# Altium schematic sheet UART Communication.SchDoc: UART Communication
size A2
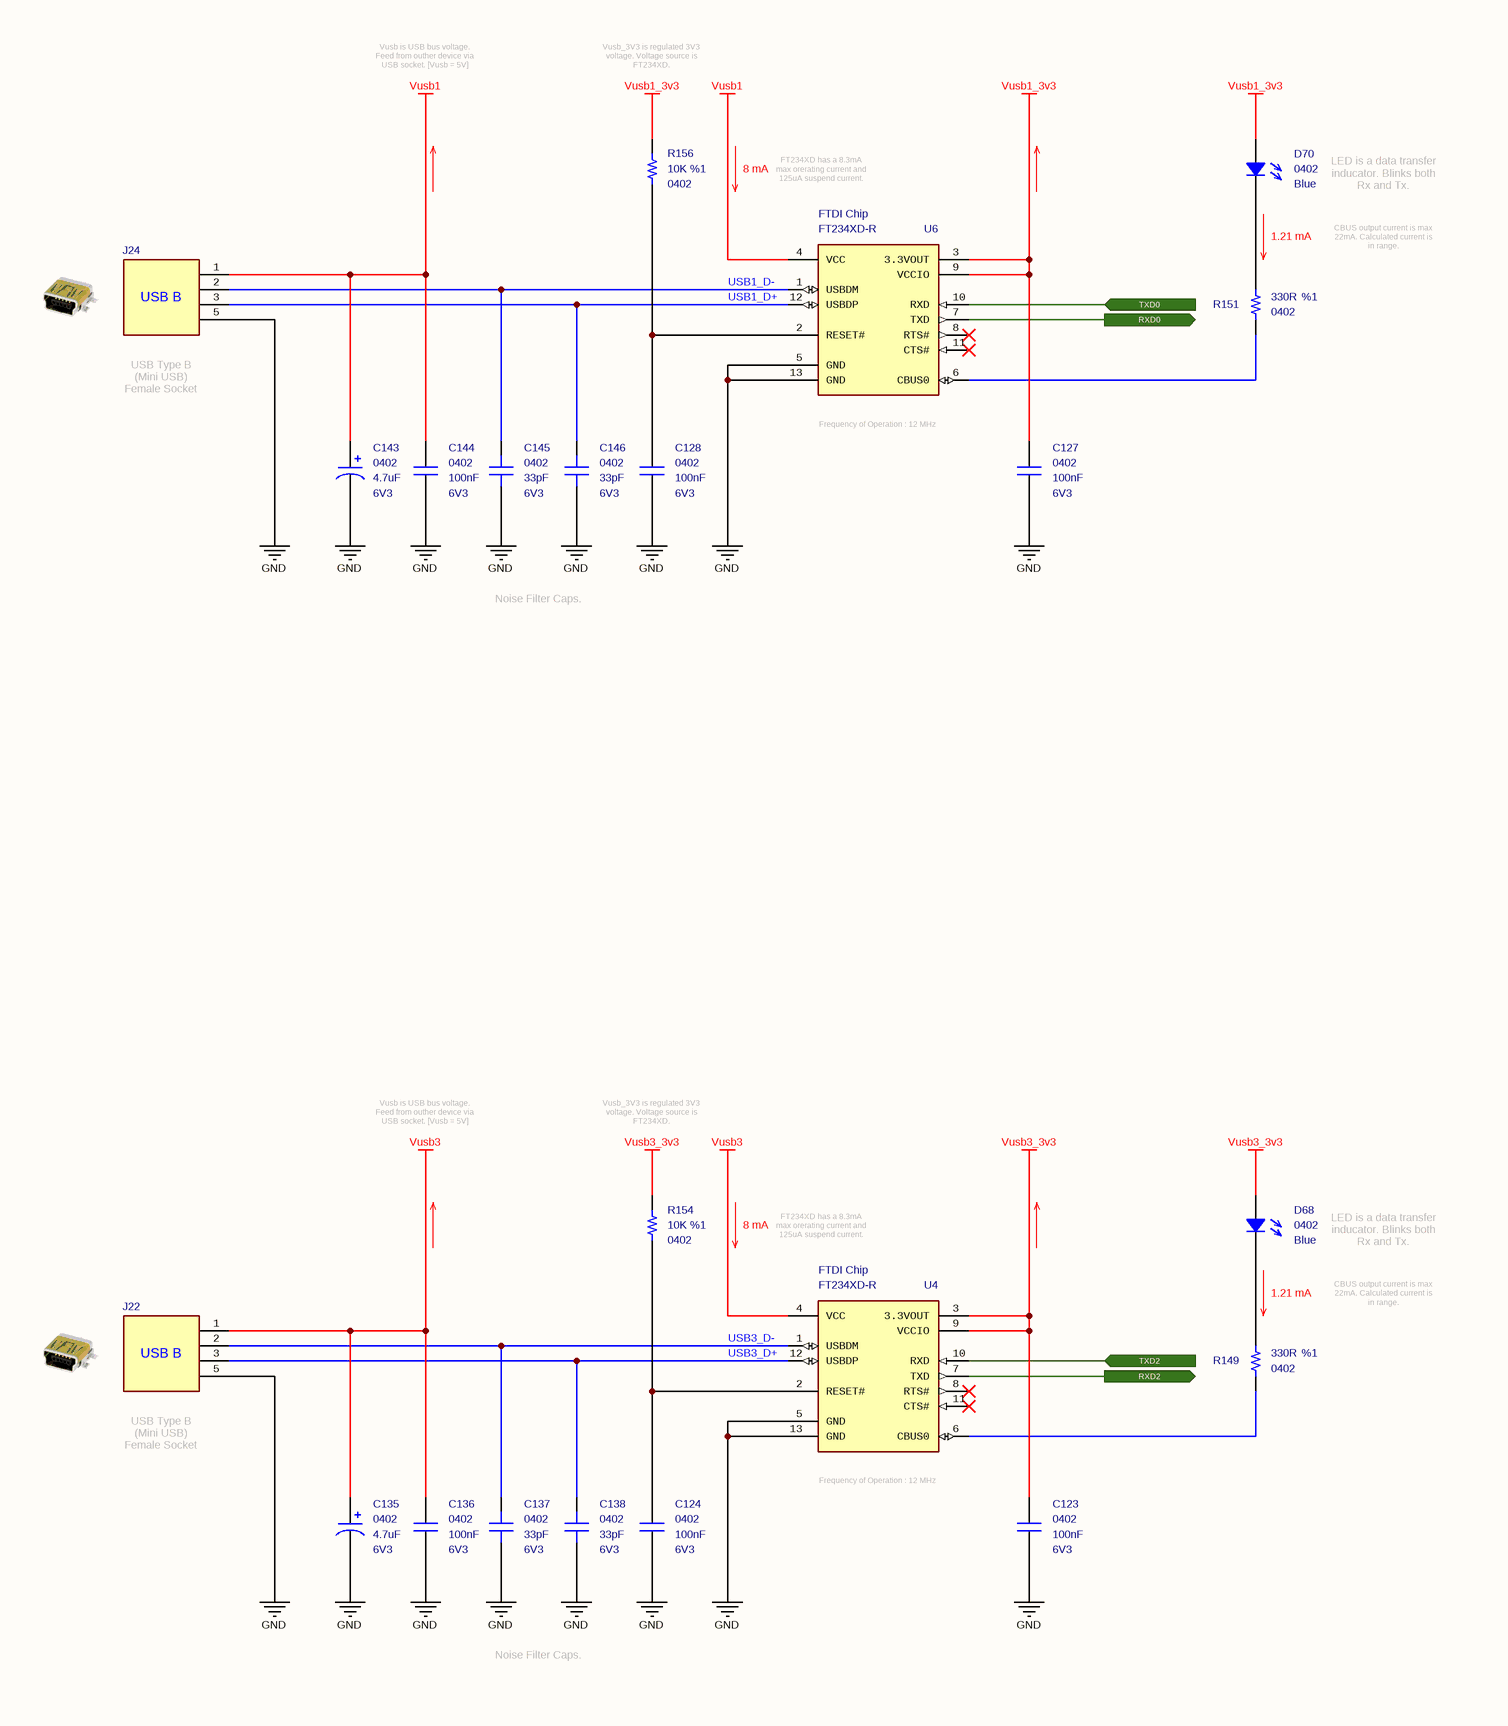
[diagram p0: UART Communication.SchDoc, left]
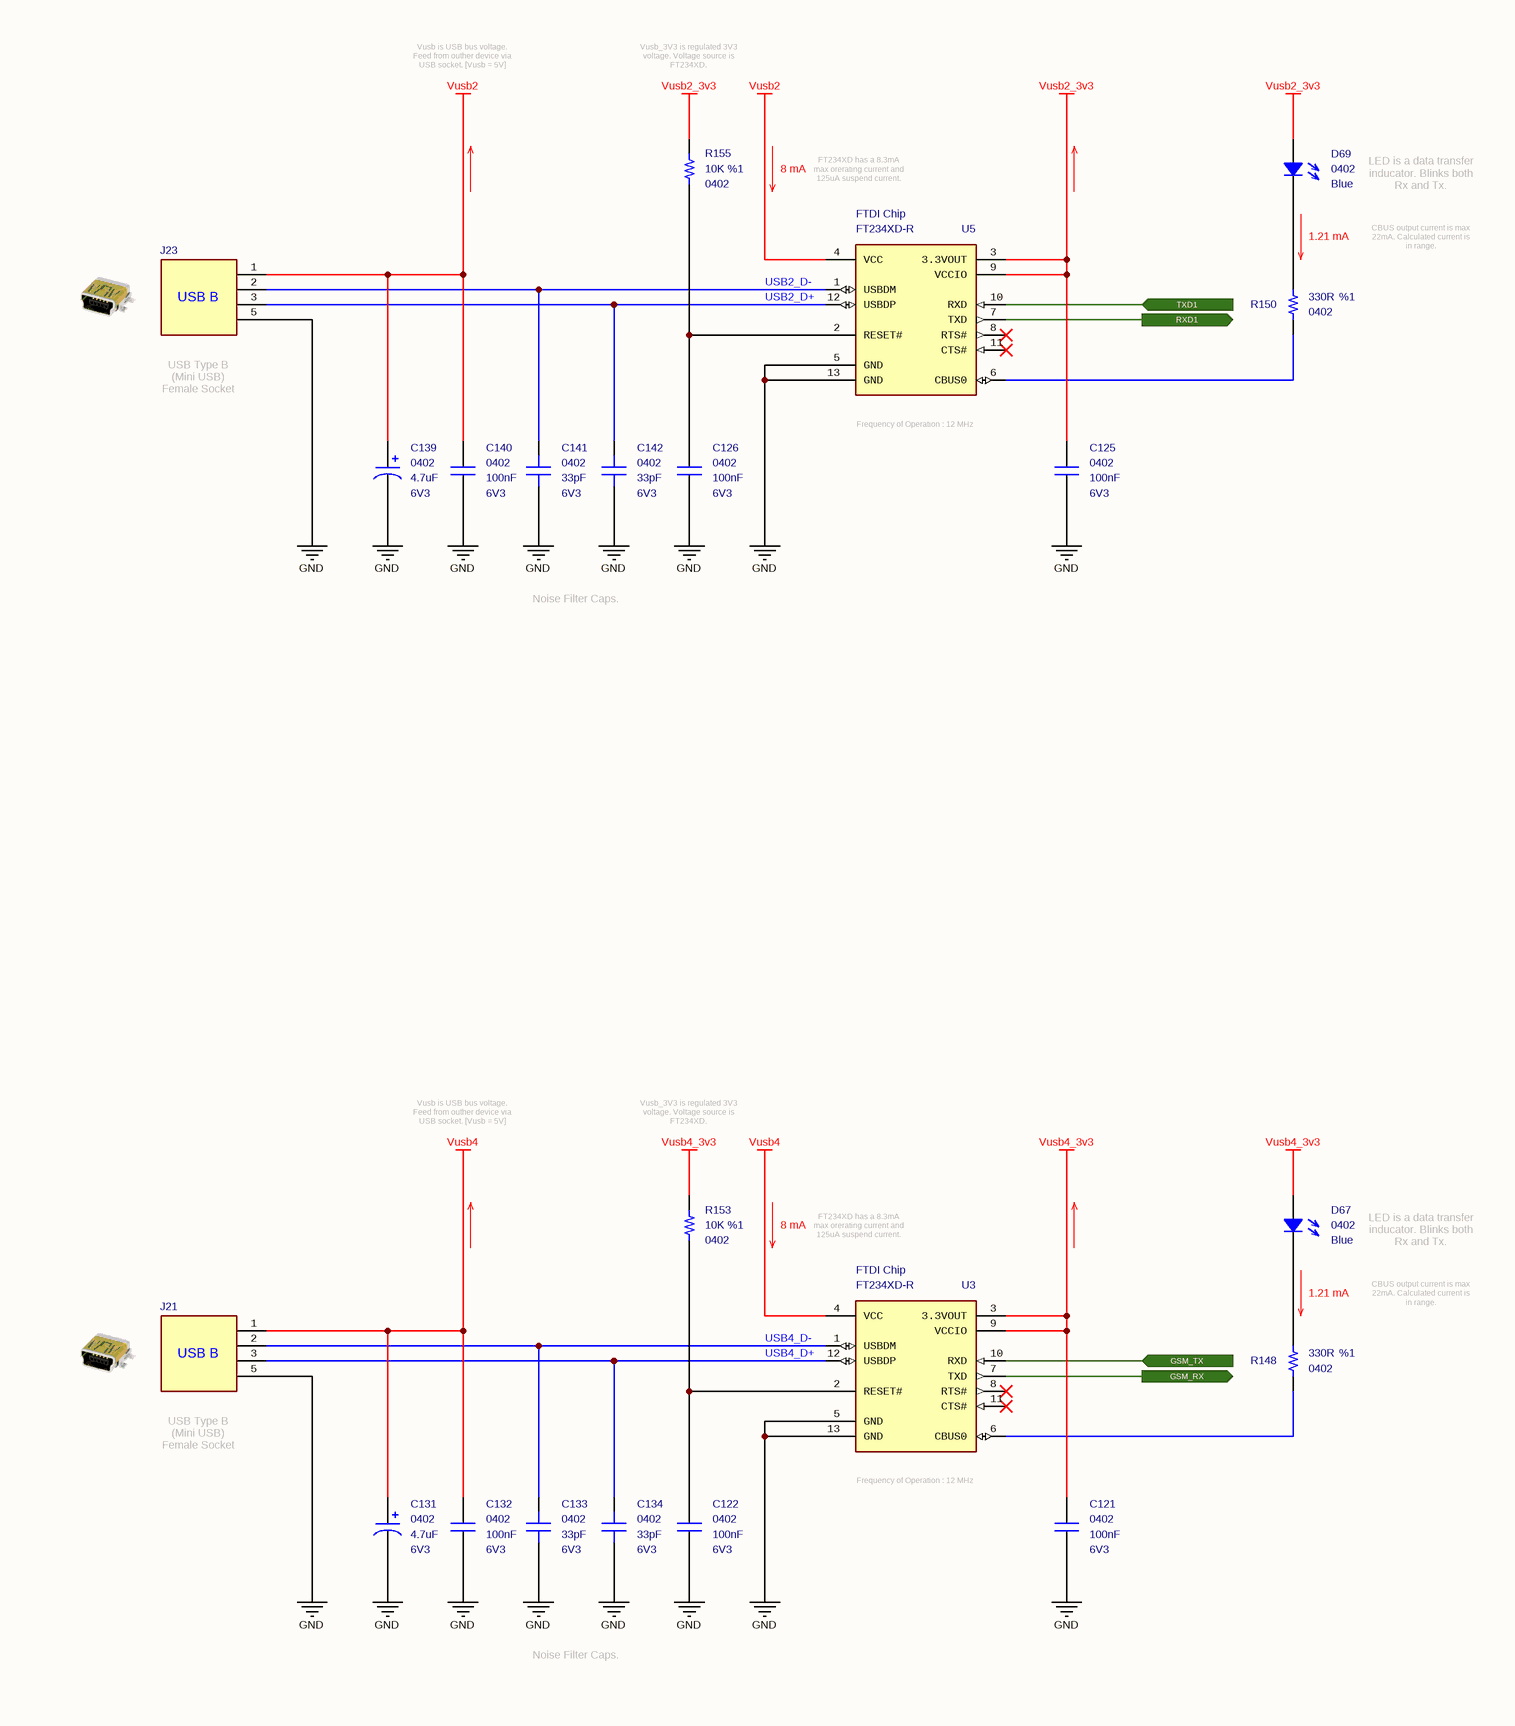
[diagram p1: UART Communication.SchDoc, right]

## Parts
C121  value 100nF  Case: 0402  Voltage: 6V3  [CAPACITOR_0402]  (hidden comment: Multilayer Ceramic Capacitor)
C122  value 100nF  Case: 0402  Voltage: 6V3  [CAPACITOR_0402]  (hidden comment: Multilayer Ceramic Capacitor)
C123  value 100nF  Case: 0402  Voltage: 6V3  [CAPACITOR_0402]  (hidden comment: Multilayer Ceramic Capacitor)
C124  value 100nF  Case: 0402  Voltage: 6V3  [CAPACITOR_0402]  (hidden comment: Multilayer Ceramic Capacitor)
C125  value 100nF  Case: 0402  Voltage: 6V3  [CAPACITOR_0402]  (hidden comment: Multilayer Ceramic Capacitor)
C126  value 100nF  Case: 0402  Voltage: 6V3  [CAPACITOR_0402]  (hidden comment: Multilayer Ceramic Capacitor)
C127  value 100nF  Case: 0402  Voltage: 6V3  [CAPACITOR_0402]  (hidden comment: Multilayer Ceramic Capacitor)
C128  value 100nF  Case: 0402  Voltage: 6V3  [CAPACITOR_0402]  (hidden comment: Multilayer Ceramic Capacitor)
C131  value 4.7uF  Case: 0402  Voltage: 6V3  [CAPACITOR_0402]  (hidden comment: Multilayer Ceramic Capacitors)
C132  value 100nF  Case: 0402  Voltage: 6V3  [CAPACITOR_0402]  (hidden comment: Multilayer Ceramic Capacitor)
C133  value 33pF  Case: 0402  Voltage: 6V3  [CAPACITOR_0402]  (hidden comment: Multilayer Ceramic Capacitor)
C134  value 33pF  Case: 0402  Voltage: 6V3  [CAPACITOR_0402]  (hidden comment: Multilayer Ceramic Capacitor)
C135  value 4.7uF  Case: 0402  Voltage: 6V3  [CAPACITOR_0402]  (hidden comment: Multilayer Ceramic Capacitors)
C136  value 100nF  Case: 0402  Voltage: 6V3  [CAPACITOR_0402]  (hidden comment: Multilayer Ceramic Capacitor)
C137  value 33pF  Case: 0402  Voltage: 6V3  [CAPACITOR_0402]  (hidden comment: Multilayer Ceramic Capacitor)
C138  value 33pF  Case: 0402  Voltage: 6V3  [CAPACITOR_0402]  (hidden comment: Multilayer Ceramic Capacitor)
C139  value 4.7uF  Case: 0402  Voltage: 6V3  [CAPACITOR_0402]  (hidden comment: Multilayer Ceramic Capacitors)
C140  value 100nF  Case: 0402  Voltage: 6V3  [CAPACITOR_0402]  (hidden comment: Multilayer Ceramic Capacitor)
C141  value 33pF  Case: 0402  Voltage: 6V3  [CAPACITOR_0402]  (hidden comment: Multilayer Ceramic Capacitor)
C142  value 33pF  Case: 0402  Voltage: 6V3  [CAPACITOR_0402]  (hidden comment: Multilayer Ceramic Capacitor)
C143  value 4.7uF  Case: 0402  Voltage: 6V3  [CAPACITOR_0402]  (hidden comment: Multilayer Ceramic Capacitors)
C144  value 100nF  Case: 0402  Voltage: 6V3  [CAPACITOR_0402]  (hidden comment: Multilayer Ceramic Capacitor)
C145  value 33pF  Case: 0402  Voltage: 6V3  [CAPACITOR_0402]  (hidden comment: Multilayer Ceramic Capacitor)
C146  value 33pF  Case: 0402  Voltage: 6V3  [CAPACITOR_0402]  (hidden comment: Multilayer Ceramic Capacitor)
D67  Case: 0402  Color: Blue  [LED_0402]  (hidden comment: SMD LED (Blue))
D68  Case: 0402  Color: Blue  [LED_0402]  (hidden comment: SMD LED (Blue))
D69  Case: 0402  Color: Blue  [LED_0402]  (hidden comment: SMD LED (Blue))
D70  Case: 0402  Color: Blue  [LED_0402]  (hidden comment: SMD LED (Blue))
J21  Mini USB Type B Connector  [USB Micro B Female - Vertical]  (value not drawn)
J22  Mini USB Type B Connector  [USB Micro B Female - Vertical]  (value not drawn)
J23  Mini USB Type B Connector  [USB Micro B Female - Vertical]  (value not drawn)
J24  Mini USB Type B Connector  [USB Micro B Female - Vertical]  (value not drawn)
R148  value 330R  Tolerance: %1  Case: 0402  [RESISTOR_0402]  (hidden comment: Thick Film Resistor)
R149  value 330R  Tolerance: %1  Case: 0402  [RESISTOR_0402]  (hidden comment: Thick Film Resistor)
R150  value 330R  Tolerance: %1  Case: 0402  [RESISTOR_0402]  (hidden comment: Thick Film Resistor)
R151  value 330R  Tolerance: %1  Case: 0402  [RESISTOR_0402]  (hidden comment: Thick Film Resistor)
R153  value 10K  Tolerance: %1  Case: 0402  [RESISTOR_0402]  (hidden comment: Thick Film Resistor)
R154  value 10K  Tolerance: %1  Case: 0402  [RESISTOR_0402]  (hidden comment: Thick Film Resistor)
R155  value 10K  Tolerance: %1  Case: 0402  [RESISTOR_0402]  (hidden comment: Thick Film Resistor)
R156  value 10K  Tolerance: %1  Case: 0402  [RESISTOR_0402]  (hidden comment: Thick Film Resistor)
U3  Manufacturer_Part_Number: FT234XD-R  Manufacturer_Name: FTDI Chip  [DFN-12]  (hidden comment: USB/UART IC)
U4  Manufacturer_Part_Number: FT234XD-R  Manufacturer_Name: FTDI Chip  [DFN-12]  (hidden comment: USB/UART IC)
U5  Manufacturer_Part_Number: FT234XD-R  Manufacturer_Name: FTDI Chip  [DFN-12]  (hidden comment: USB/UART IC)
U6  Manufacturer_Part_Number: FT234XD-R  Manufacturer_Name: FTDI Chip  [DFN-12]  (hidden comment: USB/UART IC)

## Ports
GSM_RX (out), GSM_TX (in), RXD0 (out), RXD1 (out), RXD2 (out), TXD0 (in), TXD1 (in), TXD2 (in)

## Nets
GND: C121.2 C122.2 C123.2 C124.2 C125.2 C126.2 C127.2 C128.2 C131.2 C132.1 C133.2 C134.2 C135.2 C136.1 C137.2 C138.2 C139.2 C140.1 C141.2 C142.2 C143.2 C144.1 C145.2 C146.2 J21.5(GND) J22.5(GND) J23.5(GND) J24.5(GND) U3.5(GND) U3.13(GND) U4.5(GND) U4.13(GND) U5.5(GND) U5.13(GND) U6.5(GND) U6.13(GND)
Vusb1: C143.1 C144.2 J24.1(Vbus) U6.4(VCC)
Vusb1_3v3: C127.1 D70.2 R156.2 U6.3(3.3VOUT) U6.9(VCCIO)
Vusb2: C139.1 C140.2 J23.1(Vbus) U5.4(VCC)
Vusb2_3v3: C125.1 D69.2 R155.2 U5.3(3.3VOUT) U5.9(VCCIO)
Vusb3: C135.1 C136.2 J22.1(Vbus) U4.4(VCC)
Vusb3_3v3: C123.1 D68.2 R154.2 U4.3(3.3VOUT) U4.9(VCCIO)
Vusb4: C131.1 C132.2 J21.1(Vbus) U3.4(VCC)
Vusb4_3v3: C121.1 D67.2 R153.2 U3.3(3.3VOUT) U3.9(VCCIO)
GSM_RX: U3.7(TXD) ; port GSM_RX
GSM_TX: U3.10(RXD) ; port GSM_TX
RXD0: U6.7(TXD) ; port RXD0
RXD1: U5.7(TXD) ; port RXD1
RXD2: U4.7(TXD) ; port RXD2
TXD0: U6.10(RXD) ; port TXD0
TXD1: U5.10(RXD) ; port TXD1
TXD2: U4.10(RXD) ; port TXD2
USB1_D+: C146.1 J24.3(D+) U6.12(USBDP)
USB1_D-: C145.1 J24.2(D-) U6.1(USBDM)
USB2_D+: C142.1 J23.3(D+) U5.12(USBDP)
USB2_D-: C141.1 J23.2(D-) U5.1(USBDM)
USB3_D+: C138.1 J22.3(D+) U4.12(USBDP)
USB3_D-: C137.1 J22.2(D-) U4.1(USBDM)
USB4_D+: C134.1 J21.3(D+) U3.12(USBDP)
USB4_D-: C133.1 J21.2(D-) U3.1(USBDM)
NetC122_1: C122.1 R153.1 U3.2(RESET#)
NetC124_1: C124.1 R154.1 U4.2(RESET#)
NetC126_1: C126.1 R155.1 U5.2(RESET#)
NetC128_1: C128.1 R156.1 U6.2(RESET#)
NetD67_1: D67.1 R148.1
NetD68_1: D68.1 R149.1
NetD69_1: D69.1 R150.1
NetD70_1: D70.1 R151.1
NetR148_2: R148.2 U3.6(CBUS0)
NetR149_2: R149.2 U4.6(CBUS0)
NetR150_2: R150.2 U5.6(CBUS0)
NetR151_2: R151.2 U6.6(CBUS0)

Not connected (* = marked no-connect by the designer): U3 8(RTS#)* 11(CTS#)*; U4 8(RTS#)* 11(CTS#)*; U5 8(RTS#)* 11(CTS#)*; U6 8(RTS#)* 11(CTS#)*

## Notes on the sheet
- Vusb is USB bus voltage. Feed from outher device via USB socket. [Vusb = 5V]
- Vusb_3V3 is regulated 3V3 voltage. Voltage source is FT234XD.
- 8 mA
- FT234XD has a 8.3mA max orerating current and 125uA suspend current.
- LED is a data transfer inducator. Blinks both Rx and Tx.
- 1.21 mA
- CBUS output current is max 22mA. Calculated current is in range.
- (near J24) USB Type B
  (Mini USB)
  Female Socket
- (near U6) Frequency of Operation : 12 MHz
- (near J23) USB Type B
  (Mini USB)
  Female Socket
- (near U5) Frequency of Operation : 12 MHz
- Noise Filter Caps.
- (near J22) USB Type B
  (Mini USB)
  Female Socket
- (near U4) Frequency of Operation : 12 MHz
- (near J21) USB Type B
  (Mini USB)
  Female Socket
- (near U3) Frequency of Operation : 12 MHz
- Title
- Size:
- Date:
- File:
- A2
- Number:
- Time:
- Revision:
- Sheet
- of
- (in symbol Connector - Mini USB Female (Vertical)) USB B

## Library data of the parts
C121-C128 C132 C136 C140 C144 = Capacitor - 100nF [0402-6V3]: Capacitor - 100nF [0402-6V3] (Ceramic); Manufacturer_Name: AVX; Manufacturer_Part_Number: 04026D104KAT4A; Dielectric: X5R; Tolerance: %10; Height: 0.25mm; Mouser_Part_Number: 581-04026D104KAT4A; ComponentLink1Description: Mouser; ComponentLink1URL: https://www.mouser.com.tr/ProductDetail/AVX/04026D104KAT4A?qs=sGAEpiMZZMs0AnBnWHyRQPg4iYkCw7IMED%2F4kpqgf7w%3D; ComponentLink2Description: DataSheet; ComponentLink2URL: https://www.mouser.com.tr/datasheet/2/40/cx5r-776519.pdf; ROHS: Yes; Maximum Operating Temperature: +85; Minimum Operating Temperature: -55; Supplier 1: Avnet; Supplier Part Number 1: 04026D104KAT4A
C131 C135 C139 C143 = Capacitor - 4.7uF [0402-6V3): Capacitor - 4.7uF [0402] (Ceramic); Manufacturer_Name: Kemet; Manufacturer_Part_Number: C0402C475M9PACTU; Dielectric: X5R; Tolerance: %20; Height: 0.5mm; Mouser_Part_Number: 80-C0402C475M9P; ComponentLink1Description: Mouser; ComponentLink1URL: https://www.mouser.com.tr/ProductDetail/KEMET/C0402C475M9PACTU?qs=x4XeXhDQKnr0GX0Xu9DUoQ==; ComponentLink2Description: DataSheet; ComponentLink2URL: https://www.mouser.com.tr/datasheet/2/40/cx5r-776519.pdf; ROHS: Yes; Maximum Operating Temperature: +85; Minimum Operating Temperature: -55; Supplier 1: Mouser; Supplier 2: Arrow; Supplier 3: Farnell; Supplier 4: Digi-Key; Supplier Part Number 1: 80-C0402C475M9P; Supplier Part Number 2: C0402C475M9PACTU; Supplier Part Number 3: 2750760; Supplier Part Number 4: 399-13068-1-ND
C133 C134 C137 C138 C141 C142 C145 C146 = Capacitor - 33pF [0402-6V3]: Capacitor - 33pF [0402] (Ceramic); Manufacturer_Name: Kemet; Manufacturer_Part_Number: C0402C330J9RACAUTO; Dielectric: X7R; Tolerance: 10%; Height: 0.5mm; Mouser_Part_Number: 80-C0402C330J9RAUTO; Maximum Operating Temperature: +125; Minimum Operating Temperature: -55; ROHS: Yes; ComponentLink1Description: DataSheet; ComponentLink1URL: https://api.kemet.com/component-edge/download/datasheet/C0402C330J9RACAUTO.pdf; ComponentLink2Description: Mouser; ComponentLink2URL: https://www.mouser.com/Search/Refine.aspx?Keyword=80-C0402C330J9RAUTO; Supplier 1: Mouser; Supplier Part Number 1: 80-C0402C330J9RAUTO
D67-D70 = Diode - LED (0402-Blue): Standard LEDs - SMD PICOLEDTM;BLUE LED; 25M @ 5MA; Manufacturer_Name: ROHM Semiconductor; Manufacturer_Part_Number: SMLP13BC8TT86; Mouser_Part_Number: 755-SMLP13BC8TT86; ROHS: Yes; ComponentLink1Description: DataSheet; ComponentLink1URL: https://d1d2qsbl8m0m72.cloudfront.net/en/products/databook/datasheet/opto/led/chip_mono/sml-p1-e.pdf; ComponentLink2Description: Mouser; ComponentLink2URL: https://www.mouser.com.tr/ProductDetail/ROHM-Semiconductor/SMLP13BC8TT86?qs=%2Fha2pyFaduidYDgXFKL%252BNZwCVZNUI4FlyPWWbVDx1b6ABmzS%252BS2f0w%3D%3D; Supplier 1: Mouser; Supplier 2: Digi-Key; Supplier Part Number 1: 755-SMLP13BC8TT86; Supplier Part Number 2: 846-1112-1-ND
J21-J24 = Connector - Mini USB Female (Vertical): USB Connectors MINI B RECEPT RA SMT W/ POST; Manufacturer_Part_Number: 105133-0011; Manufacturer_Name: Molex; Pitch: 0.8mm; Contact: 5; ROHS: Yes; ComponentLink1Description: DataSheet; ComponentLink1URL: https://eu.mouser.com/datasheet/2/276/1051330011_IO_CONNECTORS-704707.pdf; ComponentLink2Description: Mouser; ComponentLink2URL: https://eu.mouser.com/ProductDetail/Molex/105133-0011?qs=sGAEpiMZZMulM8LPOQ%252Byk9ef5KmzwulGtEmCDWJwe7A%3D; Case: SMD; Mouser_Part_Number: 538-105133-0011; Supplier 1: Mouser; Supplier 2: Arrow; Supplier 3: Farnell; Supplier 4: Digi-Key; Supplier Part Number 1: 538-105133-0011; Supplier Part Number 2: 105133-0011; Supplier Part Number 3: 2614949; Supplier Part Number 4: WM10134CT-ND; System: Connector
R148-R151 = Resistor - 330R: Thick Film Resistors - SMD 1/16 W 330 Ohm 1%; Manufacturer_Name: Vishay; Manufacturer_Part_Number: CRCW0402330RFKED; Height: 0.4mm; Mouser_Part_Number: 71-CRCW0402-330-E3; ComponentLink1Description: DataSheet; ComponentLink1URL: https://www.mouser.com.tr/datasheet/2/427/dcrcwe3-1762152.pdf; ComponentLink2Description: Mouser; ComponentLink2URL: https://www.mouser.com.tr/ProductDetail/Vishay-Dale/CRCW0402330RFKED?qs=sGAEpiMZZMu61qfTUdNhG2DpbjADlD3GGS6SwBlLi5Q%3D; Supplier 1: Mouser; Supplier 2: Digi-Key; Supplier Part Number 2: 541-330LCT-ND; Supplier Part Number 1: 71-CRCW0402-330-E3
R153-R156 = Resistor - 10K: Thick Film Resistors - SMD 1/16 W 10 Kohms 1%; Manufacturer_Name: Vishay; Manufacturer_Part_Number: CRCW040210K0FKED; Height: 0.4mm; Mouser_Part_Number: 71-CRCW0402-10K-E3; ComponentLink1Description: DataSheet; ComponentLink1URL: https://www.mouser.com.tr/datasheet/2/427/dcrcwe3-1762152.pdf; ComponentLink2Description: Mouser; ComponentLink2URL: https://www.mouser.com.tr/ProductDetail/Vishay-Dale/CRCW040210K0FKED?qs=sGAEpiMZZMu61qfTUdNhG2DpbjADlD3GcalbOv9utCY%3D; Supplier 1: Mouser; Supplier 2: Digi-Key; Supplier Part Number 1: 71-CRCW040210K0FKEDH; Supplier Part Number 2: 541-10.0KYCT-ND
U3-U6 = IC - FT234XD-R: Height: 0.75mm; Mouser Part Number: 895-FT234XD-R; ComponentLink1Description: DataSheet; ComponentLink1URL: https://componentsearchengine.com/Datasheets/2/FT234XD-R.pdf; ComponentLink2Description: Mouser; ComponentLink2URL: https://www.mouser.com/Search/Refine.aspx?Keyword=895-FT234XD-R; Supplier 1: Mouser; Supplier 2: Arrow; Supplier 3: Farnell; Supplier 4: Newark; Supplier 5: Digi-Key; Supplier Part Number 1: 895-FT234XD-R; Supplier Part Number 2: FT234XD-R; Supplier Part Number 3: 2419911; Supplier Part Number 4: 53X3171; Supplier Part Number 5: 768-1178-1-ND